# Altium schematic sheet micro_schem.SchDoc
size A4
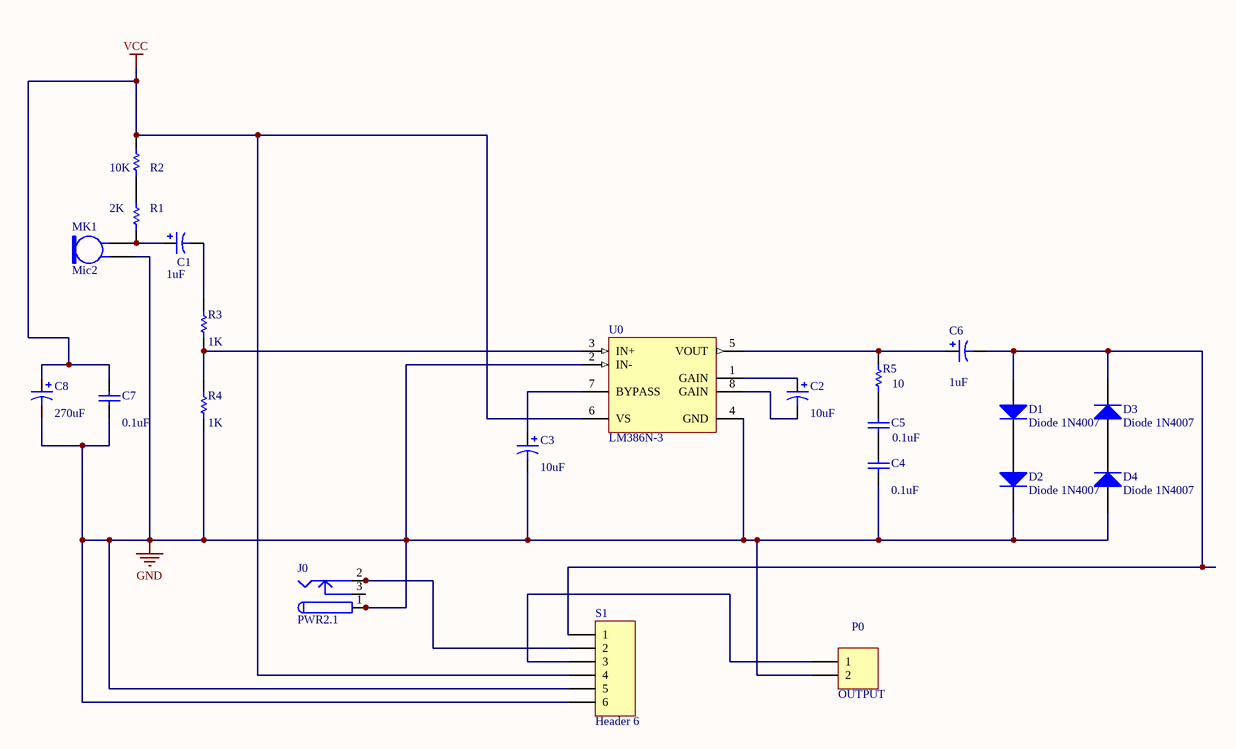
[diagram p0: micro_schem.SchDoc]

## Parts
C1  value 1uF  [RB7.6-15]
C2  value 10uF  [RB7.6-15]
C3  value 10uF  [RB7.6-15]
C4  value 0.1uF  [RAD-0.3]
C5  value 0.1uF  [RAD-0.3]
C6  value 1uF  [RB7.6-15]
C7  value 0.1uF  [RAD-0.3]
C8  value 270uF  [RB7.6-15]
D1  Diode 1N4007  [DIO10.46-5.3x2.8]
D2  Diode 1N4007  [DIO10.46-5.3x2.8]
D3  Diode 1N4007  [DIO10.46-5.3x2.8]
D4  Diode 1N4007  [DIO10.46-5.3x2.8]
J0  PWR2.1  [KLD-0202]
MK1  Mic2  [PIN2]
P0  OUTPUT  [HDR1X2]
R1  value 2K  [AXIAL-0.3]
R2  value 10K  [AXIAL-0.3]
R3  value 1K  [AXIAL-0.3]
R4  value 1K  [AXIAL-0.3]
R5  value 10  [AXIAL-0.3]
S1  Header 6  [HDR1X6]
U0  LM386N-3  [N08E]

## Nets
GND: C3.2 C4.1 C7.1 C8.2 D2.2(K) D4.1(A) J0.1 J0.1A MK1.1 P0.2 R4.1 S1.5 S1.6 U0.2(IN-) U0.4(GND)
VCC: C7.2 C8.1 R2.2 S1.4 U0.6(VS)
NetC1_1: C1.1 MK1.2 R1.1
NetC1_2: C1.2 R3.2
NetC2_1: C2.1 U0.1(GAIN)
NetC2_2: C2.2 U0.8(GAIN)
NetC3_1: C3.1 U0.7(BYPASS)
NetC4_2: C4.2 C5.1
NetC5_2: C5.2 R5.1
NetC6_1: C6.1 R5.2 U0.5(VOUT)
NetC6_2: C6.2 D1.1(A) D3.2(K) S1.1
NetD1_2: D1.2(K) D2.1(A)
NetD3_1: D3.1(A) D4.2(K)
NetJ0_2: J0.2 J0.2A S1.2
NetJ0_3: J0.3 J0.3A
NetP0_1: P0.1 S1.3
NetR1_2: R1.2 R2.1
NetR3_1: R3.1 R4.2 U0.3(IN+)

## Library data of the parts
C1-C3 C6 C8 = Cap Pol1: Polarized Capacitor (Radial); Published: 8-Jun-2000; LatestRevisionDate: 17-Jul-2002; LatestRevisionNote: Re-released for DXP Platform.; PackageReference: RB7.6-15; Publisher: Altium Limited
C4 C5 C7 = Cap: Capacitor; Published: 8-Jun-2000; LatestRevisionDate: 17-Jul-2002; LatestRevisionNote: Re-released for DXP Platform.; PackageReference: RAD-0.3; Publisher: Altium Limited
D1-D4 = Diode 1N4007: 1 Amp General Purpose Rectifier; Published: 8-Jun-2000; LatestRevisionDate: 17-Jul-2002; LatestRevisionNote: Re-released for DXP Platform.; DatasheetVersion: 1998; PackageVersion: Aug-1999; PackageReference: DO-41; Publisher: Altium Limited; Code_JEDEC: DO-204-AL; ComponentLink1Description: Manufacturer Link; ComponentLink1URL: http://www.fairchildsemi.com/; ComponentLink2Description: Datasheet; ComponentLink2URL: http://www.fairchildsemi.com/ds/1N%2F1N4001.pdf
J0 = PWR2.5: Low Voltage Power Supply Connector; Published: 17-Dec-2003; DatasheetDocument: 09-May-2002; Publisher: Altium Limited; ComponentLink1Description: Manufacturer Link; ComponentLink1URL: http://domino.kycon.com/internet/Products.html
MK1 = Mic2: Microphone; Published: 24-Mar-1999; LatestRevisionDate: 17-Jul-2002; LatestRevisionNote: Re-released for DXP Platform.; PackageReference: PIN2; Publisher: Altium Limited
P0 = Header 2: Header, 2-Pin; LatestRevisionDate: 17-Jul-2002; LatestRevisionNote: Re-released for DXP Platform.; Publisher: Altium Limited
R1-R5 = Res1: Resistor; Published: 8-Jun-2000; LatestRevisionDate: 17-Jul-2002; LatestRevisionNote: Re-released for DXP Platform.; PackageReference: AXIAL-0.3; Publisher: Altium Limited
S1 = Header 6: Header, 6-Pin; LatestRevisionDate: 17-Jul-2002; LatestRevisionNote: Re-released for DXP Platform.; Publisher: Altium Limited
U0 = LM386N-3: Low Voltage Audio Power Amplifier, 8-pin MDIP; Manufacturer: National Semiconductor; PackageTopMarking: NSUZXYTTE#*LM*386N-3; PowerWise: N; CompType: Audio IC; Published: 4-Dec-2008; DatasheetVersion: Aug-2000; PackageVersion: revG, May-2006; PackageReference: N08E; Publisher: Altium Limited; PackageDescription: MDIP, .365 x .250 x .130in, 8 Lead, .100in Pitch; Supplier 1: Farnell; Supplier Part Number 1: 9488340; PartNumber: LM386N-3; RoHS: N; PinCount: 8; Code_JEDEC: MS-001-BA; ComponentLink1Description: LM386 Datasheet; ComponentLink1URL: http://www.national.com/ds/LM/LM386.pdf; ComponentLink2Description: LM386 Web Page; ComponentLink2URL: http://www.national.com/pf/LM/LM386.html; ComponentLink3Description: N08E Package Page; ComponentLink3URL: http://www.national.com/packaging/folders/n08e.html